# EAGLE design binary_clock_rev2 (EAGLE 6.0)
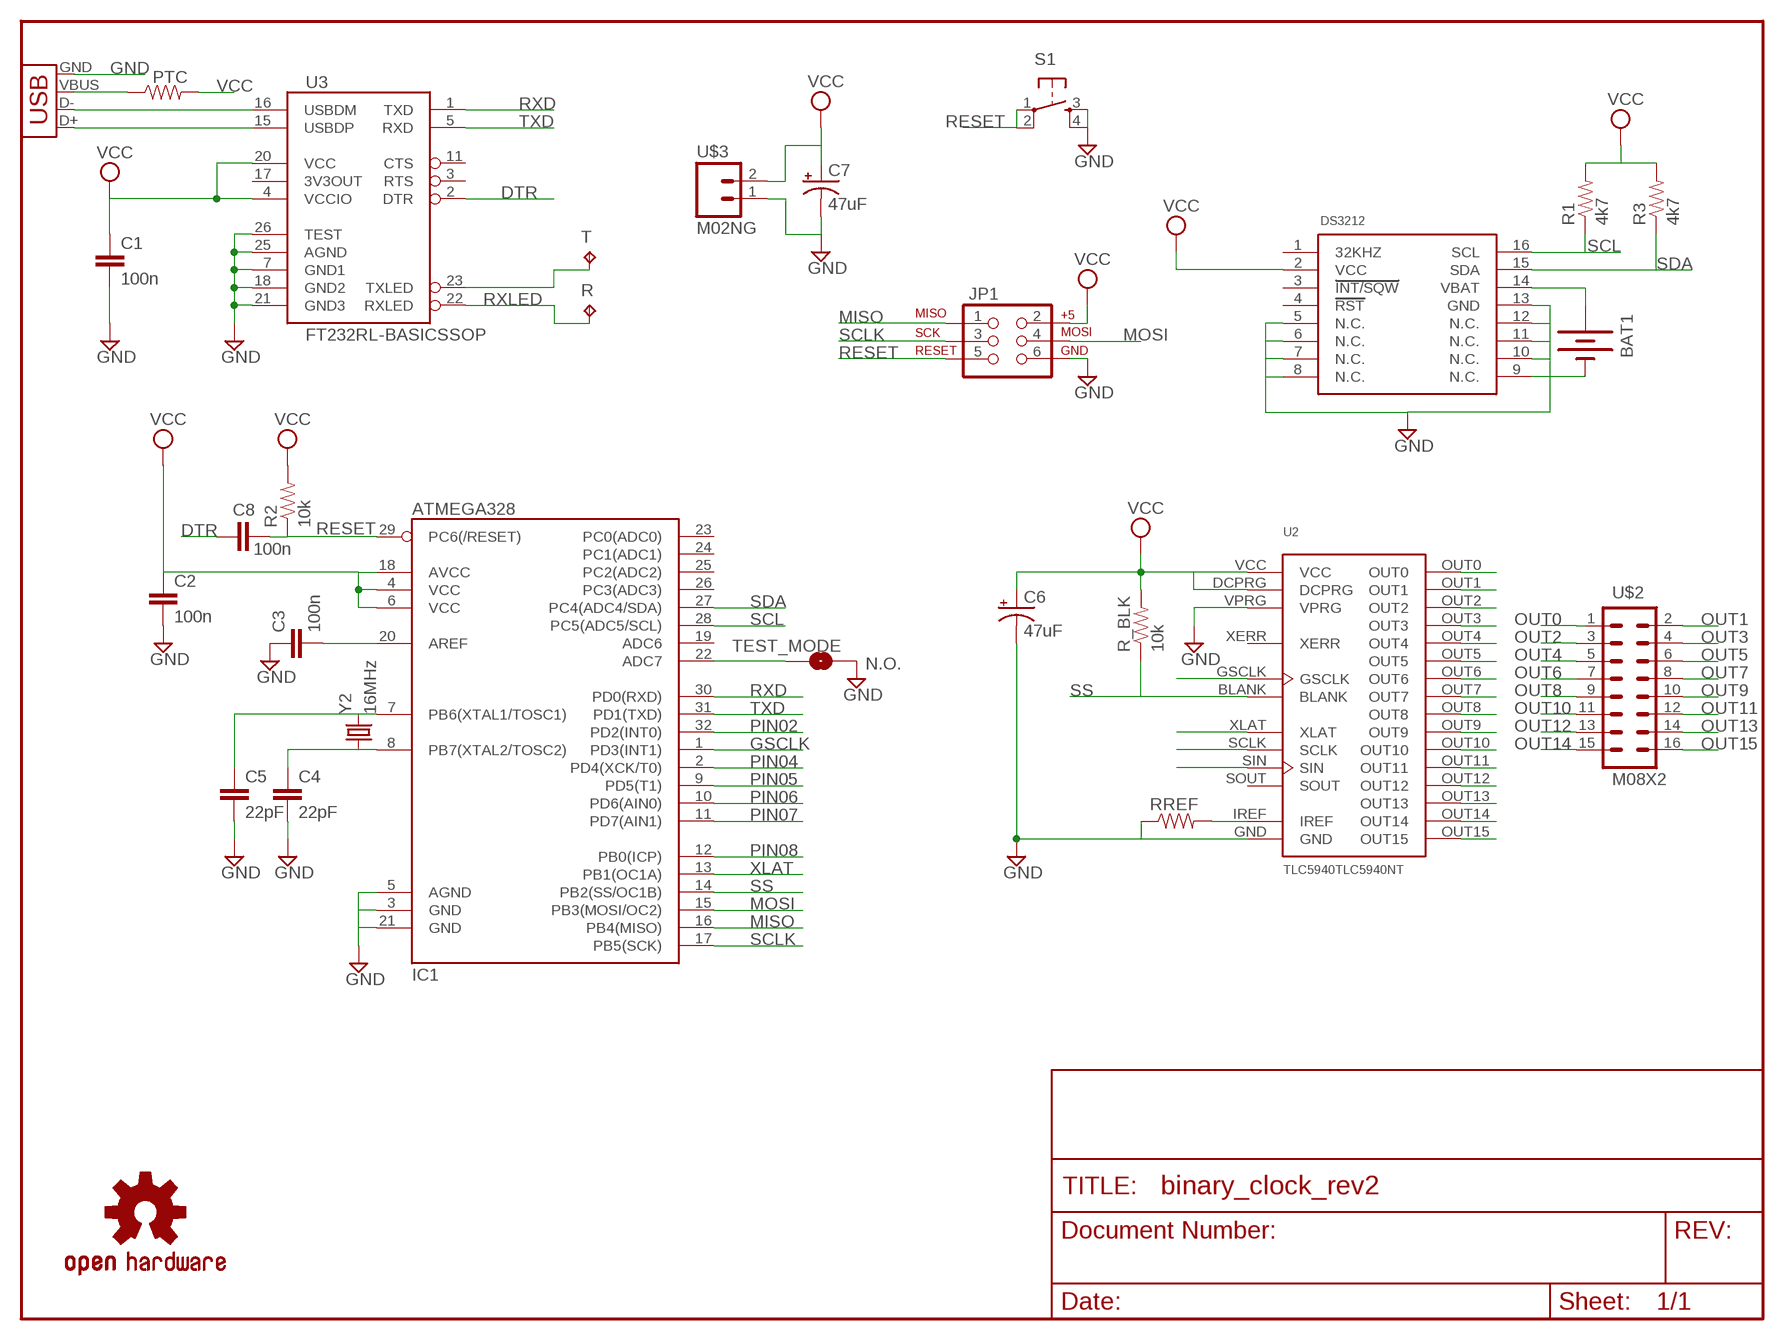
[diagram p0: schematic, sheet 1]

## Parts
BAT1  BATTERY12MM  [BATTCON_12MM]
C1  100n  CAP1206  [1206]
C2  100n  CAP1206  [1206]
C3  100n  CAP1206  [1206]
C4  22pF  CAP1206  [1206]
C5  22pF  CAP1206  [1206]
C6  47uF  CPOL-USD/7343-31W  [D/7343-31W]
C7  47uF  CPOL-USD/7343-31W  [D/7343-31W]
C8  100n  CAP1206  [1206]
DS3212  DS3231  [SO16L]
IC1  ATMEGA328  ATMEGA168  [TQFP32-08]
JP1  AVR_SPI_PRG_62X3_LOCK  [2X3_LOCK]
PTC  RESISTOR1206  [1206]
R  TPB1,27  [B1,27]
R1  4k7  RESISTOR1206  [1206]
R2  10k  RESISTOR1206  [1206]
R3  4k7  RESISTOR1206  [1206]
R_BLK  10k  RESISTOR1206  [1206]
RREF  2.2k  RESISTOR1206  [1206]
S1  TAC_SWITCHSMD  [TACTILE_SWITCH_SMD]
T  TPB1,27  [B1,27]
TEST_MODE  N.O.  SOLDERJUMPERNO  [SJ_2S-NO]
U2  TLC5940TLC5940NT  [DIL28-3]
U3  FT232RL-BASICSSOP  [SSOP28DB]
U$1  OSHW-LOGOM  [OSHW-LOGO-M]
U$2  M08X2  [2X8]
U$3  M02NG  [1X02]
X1  USBSMD  [USB-MINIB]
Y2  16MHz  CRYSTALHC49US  [HC49US]

## Nets
DTR: C8.1 U3.2(DTR)
GND: BAT1.GND(-) C1.2 C2.2 C3.1 C4.2 C5.2 C6.- C7.- DS3212.5(N.C.) DS3212.6(N.C.) DS3212.7(N.C.) DS3212.8(N.C.) DS3212.9(N.C.) DS3212.10(N.C.) DS3212.11(N.C.) DS3212.12(N.C.) DS3212.13(GND) IC1.3(GND) IC1.5(AGND) IC1.21(GND) JP1.6 RREF.1 S1.3 S1.4 TEST_MODE.2 U2.GND U2.VPRG U3.7(GND1) U3.18(GND2) U3.21(GND3) U3.25(AGND) U3.26(TEST) U$3.1 X1.GND
GSCLK: IC1.1(PD3(INT1)) U2.GSCLK
MISO: IC1.16(PB4(MISO)) JP1.1
MOSI: IC1.15(PB3(MOSI/OC2)) JP1.4 U2.SIN
N$1: IC1.22(ADC7) TEST_MODE.1
N$2: BAT1.PWR@2(+) DS3212.14(VBAT)
N$14: U3.15(USBDP) X1.D+
N$15: U3.16(USBDM) X1.D-
N$16: C3.2 IC1.20(AREF)
N$17: PTC.1 X1.VBUS
N$18: RREF.2 U2.IREF
N$21: C5.1 IC1.7(PB6(XTAL1/TOSC1)) Y2.2
N$22: C4.1 IC1.8(PB7(XTAL2/TOSC2)) Y2.1
OUT0: U2.OUT0 U$2.1
OUT1: U2.OUT1 U$2.2
OUT2: U2.OUT2 U$2.3
OUT3: U2.OUT3 U$2.4
OUT4: U2.OUT4 U$2.5
OUT5: U2.OUT5 U$2.6
OUT6: U2.OUT6 U$2.7
OUT7: U2.OUT7 U$2.8
OUT8: U2.OUT8 U$2.9
OUT9: U2.OUT9 U$2.10
OUT10: U2.OUT10 U$2.11
OUT11: U2.OUT11 U$2.12
OUT12: U2.OUT12 U$2.13
OUT13: U2.OUT13 U$2.14
OUT14: U2.OUT14 U$2.15
OUT15: U2.OUT15 U$2.16
PIN02: IC1.32(PD2(INT0))
PIN04: IC1.2(PD4(XCK/T0))
PIN05: IC1.9(PD5(T1))
PIN06: IC1.10(PD6(AIN0))
PIN07: IC1.11(PD7(AIN1))
PIN08: IC1.12(PB0(ICP))
RESET: C8.2 IC1.29(PC6(/RESET)) JP1.5 R2.1 S1.1 S1.2
RXD: IC1.30(PD0(RXD)) U3.1(TXD)
RXLED: R.TP U3.22(RXLED)
SCL: DS3212.16(SCL) IC1.28(PC5(ADC5/SCL)) R1.1
SCLK: IC1.17(PB5(SCK)) JP1.3 U2.SCLK
SDA: DS3212.15(SDA) IC1.27(PC4(ADC4/SDA)) R3.1
SS: IC1.14(PB2(SS/OC1B)) R_BLK.1 U2.BLANK
TXD: IC1.31(PD1(TXD)) U3.5(RXD)
TXLED: T.TP U3.23(TXLED)
VCC: C1.1 C2.1 C6.+ C7.+ DS3212.2(VCC) IC1.4(VCC) IC1.6(VCC) IC1.18(AVCC) JP1.2 PTC.2 R1.2 R2.2 R3.2 R_BLK.2 U2.DCPRG U2.VCC U3.4(VCCIO) U3.20(VCC) U$3.2
XLAT: IC1.13(PB1(OC1A)) U2.XLAT
Unconnected: DS3212.1(32KHZ) DS3212.3(INT/SQW) DS3212.4(RST) IC1.19(ADC6) IC1.23(PC0(ADC0)) IC1.24(PC1(ADC1)) IC1.25(PC2(ADC2)) IC1.26(PC3(ADC3)) U2.SOUT U2.XERR U3.3(RTS) U3.11(CTS) U3.17(3V3OUT)

## Library data of the parts
BAT1 = Add-Ohms:BATTERY: Battery Holders Various common sizes : AA, AAA, 20mm coin cell and 12mm coin cell.
C1-C3 C8 = SparkFun:CAP: Capacitor Standard 0603 ceramic capacitor, and 0.1" leaded capacitor.
C4 C5 = JitterLab:CAP: Capacitor Standard 0603 ceramic capacitor, and 0.1" leaded capacitor.
C6 C7 = rcl:CPOL-US: POLARIZED CAPACITOR, American symbol
DS3212 = Add-Ohms:DS3231: The DS3231 is a low-cost, extremely accurate I2C real- time clock (RTC) with an integrated temperature- compensated crystal oscillator (TCXO) and crystal. Link to maxim-ic.com: http://www.maxim-ic.com/datasheet/index.mvp/id/4627 The package style is the SOIC-16. This Part was created by James Lewis (james@cmiyc.com). The SMD/PCB footprint was obtained from the Sparkfun Eagle Library. This part (as an indepedant library) can be downloaded from cmiyc.com: <insert link>. Last Update: May 28, 2012.
IC1 = SparkFun:ATMEGA168
JP1 = SparkFun:AVR_SPI_PRG_6: AVR ISP 6 Pin This is the reduced ISP connector for AVR programming. Common on Arduino. This footprint will take up less PCB space and can be used with a 10-pin to 6-pin adapter such as SKU: BOB-08508
PTC R1-R3 = SparkFun:RESISTOR: Resistor Basic schematic elements and footprints for 0603, 1206, and PTH resistors.
R T = testpad:TP: Test pad
R_BLK RREF = JitterLab:RESISTOR: Resistor Basic schematic elements and footprints for 0603, 1206, and PTH resistors.
S1 = SparkFun:TAC_SWITCH: Momentary Switch Button commonly used for reset or general input. Spark Fun Electronics SKU : COM-00097
TEST_MODE = SparkFun:SOLDERJUMPER: Solder Jumper Standard SMD solder jumper. Used to automate production. Two varients : Normally Open and Normally Closed are the same, but have different paste layers. NC will have a large amount of paste and should jumper during reflow.
U2 = TLC5940NT:TLC5940
U3 = SparkFun:FT232RL-BASIC: USB UART This is the simplified version of the FT232RL unit. Only what you need, nothing you don't. Spark Fun Electronics SKU : COM-00650
U$1 = Add-Ohms:OSHW-LOGO: Open Source Hardware Logo This logo indicates the piece of hardware it is found on incorporates a OSHW license and/or adheres to the definition of open source hardware found here: http://freedomdefined.org/OSHW
U$2 = SparkFun:M08X2
U$3 = SparkFun:M02NG
X1 = SparkFun:USB: USB Connectors USB-B-PTH is fully proven SKU : PRT-00139 USB-miniB is fully proven SKU : PRT-00587 USB-A-PCB is untested. USB-A-H is throughly reviewed, but untested. Spark Fun Electronics SKU : PRT-00437 USB-B-SMT is throughly reviewed, but untested. Needs silkscreen touching up. USB-A-S has not been used/tested USB-MB-H has not been used/tested
Y2 = SparkFun:CRYSTAL: Crystals Various standard crystals. Proven footprints. Spark Fun Electronics SKU : COM-00534

## Board
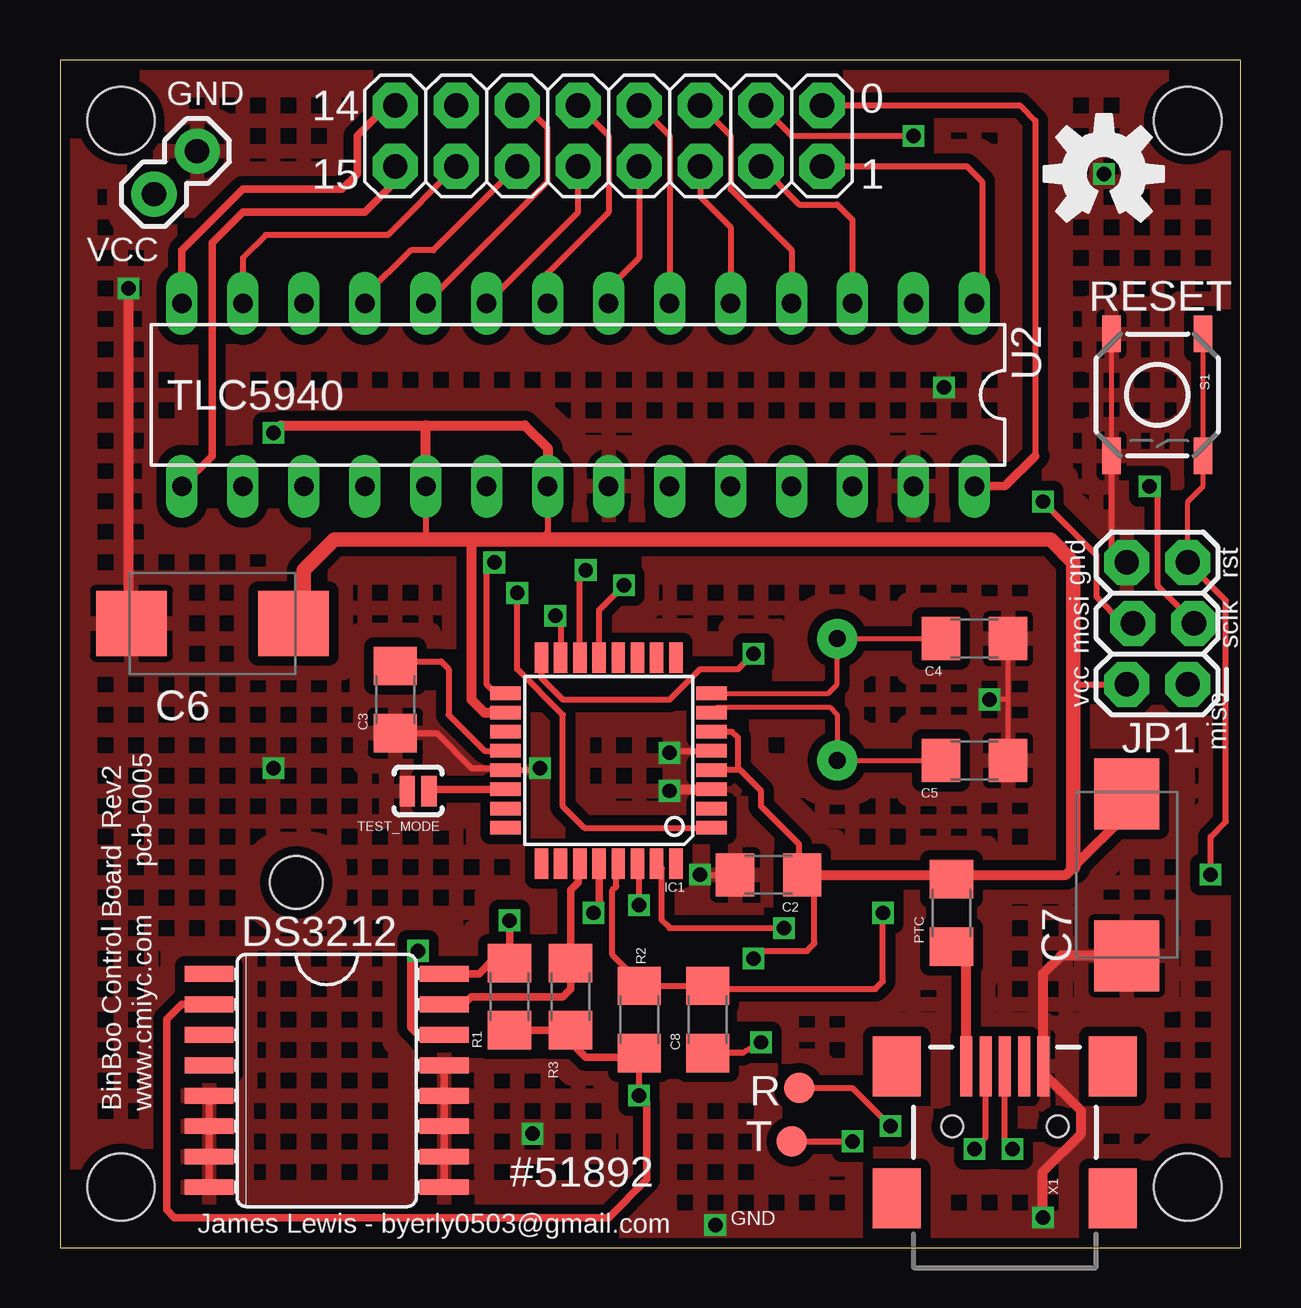
[diagram p1: board, top side]
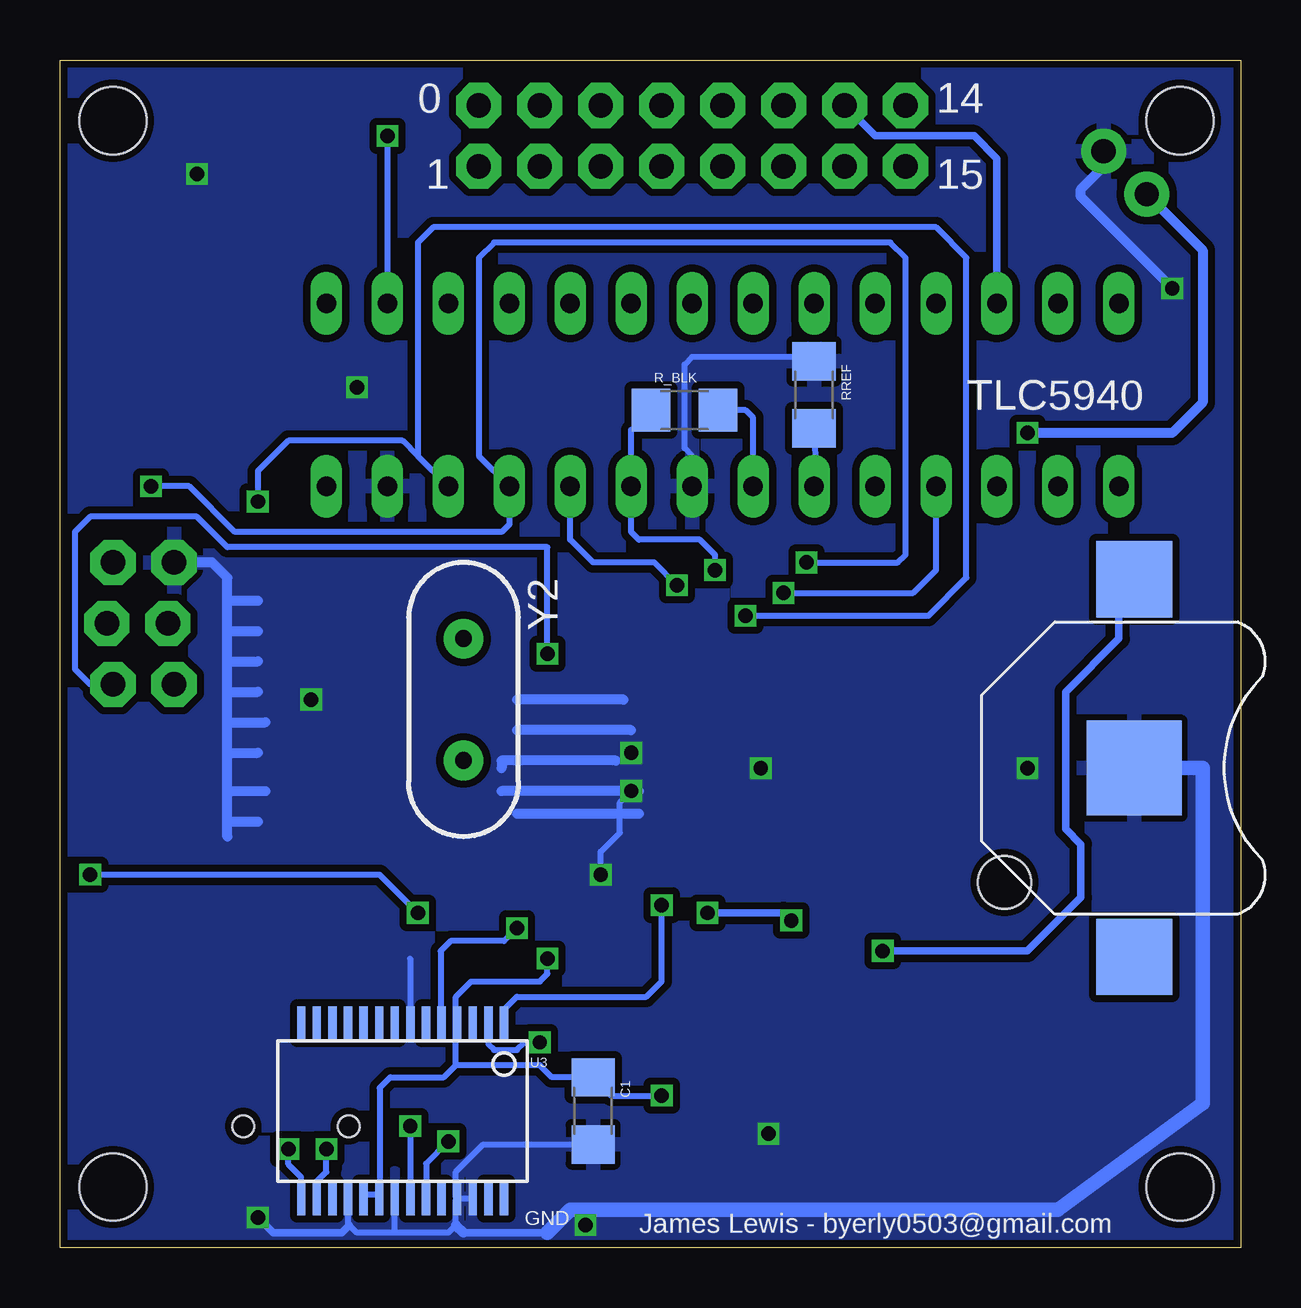
[diagram p2: board, bottom side, seen from below]

Size 49.2 x 49.52 mm. Coordinates in mm from the lower left corner, seen from the top.
Outline: 0,0 49.2,0 49.2,49.52 0,49.52 0,0
Copper layers (1*16): Top 0.035mm / dielectric 1.5mm / Bottom 0.035mm
Design rules: minimum track width 6mil, minimum drill 12mil, track to track 6mil, track to pad 6mil, pad to pad 6mil, via to via 6mil, smd to smd 0mil, copper to edge 10mil, drill to drill 10mil, minimum pad ring 10mil, minimum via ring 6mil, stop-mask expansion 2mil, vias tented up to drill 100mil, thermal gap 10mil
Holes 2.8 mm at 46.99,46.99 46.99,2.54 2.54,2.54 2.54,46.99
Holes 2.2 mm at 9.84,15.24

### Footprints (pad centres in the part's own frame; a part is rotated, then mirrored left to right if it is on the bottom)
BATTCON_12MM = smd 3.962 x 3.962: GND 0,0 | smd 3.175 x 3.175: PWR@1 7.874,0; PWR@2 -7.874,0
1206 = smd 1.6 x 1.8: 1 -1.4,0; 2 1.4,0
D/7343-31W = smd 2.95 x 2.7: + 3.375,0; - -3.375,0
SO16L = smd 0.66 x 2.032: 1 -4.445,-4.902; 2 -3.175,-4.902; 3 -1.905,-4.902; 4 -0.635,-4.902; 5 0.635,-4.902; 6 1.905,-4.902; 7 3.175,-4.902; 8 4.445,-4.902; 9 4.445,4.902; 10 3.175,4.902; 11 1.905,4.902; 12 0.635,4.902; 13 -0.635,4.902; 14 -1.905,4.902; 15 -3.175,4.902; 16 -4.445,4.902
TQFP32-08 = smd 1.27 x 0.559: 1 -4.293,2.8; 2 -4.293,2; 3 -4.293,1.2; 4 -4.293,0.4; 5 -4.293,-0.4; 6 -4.293,-1.2; 7 -4.293,-2; 8 -4.293,-2.8; 17 4.293,-2.8; 18 4.293,-2; 19 4.293,-1.2; 20 4.293,-0.4; 21 4.293,0.4; 22 4.293,1.2; 23 4.293,2; 24 4.293,2.8 | smd 0.559 x 1.27: 9 -2.8,-4.293; 10 -2,-4.293; 11 -1.2,-4.293; 12 -0.4,-4.293; 13 0.4,-4.293; 14 1.2,-4.293; 15 2,-4.293; 16 2.8,-4.293; 25 2.8,4.293; 26 2,4.293; 27 1.2,4.293; 28 0.4,4.293; 29 -0.4,4.293; 30 -1.2,4.293; 31 -2,4.293; 32 -2.8,4.293
2X3_LOCK = drill 1.016 pad 1.88 octagon: 1 0,0; 2 0,2.54; 3 2.54,-0.254; 4 2.54,2.286; 5 5.08,0; 6 5.08,2.54
B1,27 = smd 1.27 x 1.27: TP 0,0
TACTILE_SWITCH_SMD = smd 1.524 x 0.762: 1 -2.54,1.905; 2 2.54,1.905; 3 -2.54,-1.905; 4 2.54,-1.905
SJ_2S-NO = smd 0.635 x 1.27: 1 -0.45,0; 2 0.45,0
DIL28-3 = drill 0.813 long: BLANK -3.81,3.81; DCPRG 6.35,3.81; GND -1.27,3.81; GSCLK 8.89,3.81; IREF 3.81,3.81; OUT0 -16.51,3.81; OUT1 -16.51,-3.81; OUT2 -13.97,-3.81; OUT3 -11.43,-3.81; OUT4 -8.89,-3.81; OUT5 -6.35,-3.81; OUT6 -3.81,-3.81; OUT7 -1.27,-3.81; OUT8 1.27,-3.81; OUT9 3.81,-3.81; OUT10 6.35,-3.81; OUT11 8.89,-3.81; OUT12 11.43,-3.81; OUT13 13.97,-3.81; OUT14 16.51,-3.81; OUT15 16.51,3.81; SCLK -8.89,3.81; SIN -11.43,3.81; SOUT 11.43,3.81; VCC 1.27,3.81; VPRG -13.97,3.81; XERR 13.97,3.81; XLAT -6.35,3.81
SSOP28DB = smd 0.348 x 1.397: 1 -4.225,-3.656; 2 -3.575,-3.656; 3 -2.925,-3.656; 4 -2.275,-3.656; 5 -1.625,-3.656; 6 -0.975,-3.656; 7 -0.325,-3.656; 8 0.325,-3.656; 9 0.975,-3.656; 10 1.625,-3.656; 11 2.275,-3.656; 12 2.925,-3.656; 13 3.575,-3.656; 14 4.225,-3.656; 15 4.225,3.656; 16 3.575,3.656; 17 2.925,3.656; 18 2.275,3.656; 19 1.625,3.656; 20 0.975,3.656; 21 0.325,3.656; 22 -0.325,3.656; 23 -0.975,3.656; 24 -1.625,3.656; 25 -2.275,3.656; 26 -2.925,3.656; 27 -3.575,3.656; 28 -4.225,3.656
2X8 = drill 1.016 pad 1.88 octagon: 1 0,0; 2 0,2.54; 3 2.54,0; 4 2.54,2.54; 5 5.08,0; 6 5.08,2.54; 7 7.62,0; 8 7.62,2.54; 9 10.16,0; 10 10.16,2.54; 11 12.7,0; 12 12.7,2.54; 13 15.24,0; 14 15.24,2.54; 15 17.78,0; 16 17.78,2.54
1X02 = drill 1.016 pad 1.88: 1 0,0; 2 2.54,0
USB-MINIB = smd 2.5 x 0.5: D+ 2.5,0; D- 2.5,0.8; GND 2.5,-1.6; ID 2.5,-0.8; VBUS 2.5,1.6 | smd 2.5 x 2: MTN1 -3,4.5; MTN2 2.5,4.5; MTN3 -3,-4.5; MTN4 2.5,-4.5 | hole 0.9: 0,2.2; 0,-2.2
HC49US = drill 0.7 pad 1.651: 1 -2.54,0; 2 2.54,0

### Placement (x,y rotation side)
BAT1  4.45,20 270 bottom
C1  26.99,5.71 270 bottom
C2  29.53,15.56 180 top
C3  13.97,22.86 90 top
C4  38.1,25.4 0 top
C5  38.1,20.32 0 top
C6  6.35,26.04 0 top
C7  44.45,15.56 90 top
C8  26.99,9.53 90 top
DS3212  11.11,6.99 270 top
IC1  22.86,20.32 180 top
JP1  46.99,23.5 90 top
PTC  37.15,13.97 90 top
R  30.8,6.67 0 top
R1  18.73,10.48 270 top
R2  24.13,9.53 270 top
R3  21.27,10.48 270 top
R_BLK  23.18,34.92 0 bottom
RREF  17.78,35.56 270 bottom
S1  45.72,35.56 270 top
T  30.48,4.45 0 top
TEST_MODE  14.92,19.05 180 top
U2  21.59,35.56 180 top
U3  34.92,5.71 180 bottom
U$1  43.5,44.77 0 top
U$2  31.75,47.62 180 top
U$3  5.71,45.72 225 top
X1  39.37,5.08 90 top
Y2  32.38,22.86 270 bottom

### Tracks (layer width: path | path; a pad name or v marks a point on that pad's centre or on a via)
DTR  (via drill 0.6)
  Top 0.254: v29.21,8.57 28.45,8.12 C8.1
  Bottom 0.254: U3.2 31.35,8.49 31.11,8.26 30.16,8.26 29.84,8.57 v29.21,8.57
GND  (via drill 0.6)
  Top 0.203: C5.2 39.5,22.86 | 39.5,22.86 C4.2 | 39.5,22.86 v38.73,22.86 | S1.4 S1.3
  Top 0.254: v20,20 19.92,19.92 IC1.21 18.48,20 17.14,20 15.69,21.46 C3.1 | v25.4,19.05 25.56,18.89 | v26.67,15.56 C2.2 | IC1.5 25.48,20.72 v25.4,20.64 | S1.4 43.81,29.21 JP1.6
  Top 0.305: DS3212.13 DS3212.12 DS3212.11 DS3212.10 DS3212.9 | DS3212.8 DS3212.7 DS3212.6 DS3212.5
  Top 0.406: IC1.3 25.47,19.12 v25.4,19.05 | v40.96,1.27 40.96,3.17 42.55,4.76 42.55,5.71 40.97,7.29 X1.GND 40.97,8.59 40.96,8.6 40.96,11.43 41.71,12.18 C7.- | C6.- 2.86,26.15 v2.86,40.01
  Top 0.61: JP1.6 44.45,29.21
  Bottom 0.254: U3.18 37.2,1 37.15,0.95 36.83,0.64 35.24,0.64 | 35.24,0.64 33.02,0.64 32.7,0.95 32.7,1.91 | 32.7,1.91 32.7,2.01 U3.25 | U3.21 35.25,0.64 35.24,0.64 | C1.2 31.56,4.32 32.7,3.17 32.7,2.11 U3.25 | 34.61,12.06 U3.7 | v20,20 20.32,20 | v26.67,15.56 26.67,16.51 25.88,17.3 25.88,18.57 v25.4,19.05 | 25.08,20.64 v25.4,20.64 | U3.26 32.55,2.06 32.65,1.96 | U3.25 32.65,1.96 | 32.65,1.96 32.7,1.91 | U2.GND 22.86,33.02 23.18,33.34 23.18,36.83 22.86,37.15 17.97,37.15 RREF.1
  Bottom 0.305: v40.96,1.27 40.32,0.64 37.47,0.64 37.15,0.95 | 28.89,0.64 32.38,0.64
  Bottom 0.406: 32.38,0.64 32.7,0.95 | 26.04,20.32 30.8,20.32 30.8,20 | 30.8,19.05 v25.4,19.05 25.08,19.05 | JP1.6 42.86,28.57 42.23,27.94 42.23,26.99 | 42.23,17.14 42.23,17.78 | 42.23,17.78 42.23,19.05 | 42.23,19.05 42.23,20.64 | 42.23,20.64 42.23,21.91 | 42.23,21.91 42.23,23.18 | 42.23,23.18 42.23,24.45 | 42.23,24.45 42.23,25.72 | 42.23,25.72 42.23,26.99 | 42.23,17.78 40.96,17.78 | 42.23,19.05 40.64,19.05 | 42.23,20.64 40.96,20.64 | 42.23,21.91 40.64,21.91 | 42.23,23.18 40.96,23.18 | 42.23,24.45 40.96,24.45 | 42.23,25.72 40.96,25.72 | 42.23,26.99 40.96,26.99 | 25.72,22.86 30.16,22.86 | 25.4,21.59 30.16,21.59 | 25.08,18.1 30.16,18.1 | v2.86,40.01 6.67,43.81 6.67,44.13 5.71,45.09 U$3.1
  Bottom 0.61: 28.89,0.64 27.94,1.59 7.62,1.59 1.59,6.03 1.59,20 BAT1.GND
  other vias: 43.5,44.77 19.68,4.76 8.89,20 36.83,35.88 27.3,0.95
  pour Bottom (isolate 0.305): 19.68,23.5 26.04,23.5 26.04,17.14 19.68,17.14
  pour Bottom (isolate 0.305): 30.8,28.57 40.96,28.57 40.96,16.83 29.84,16.83 29.84,28.57
  pour Bottom (isolate 0.305): 0.32,49.21 48.9,49.21 48.9,0.64 0.32,0.64
  pour Top (isolate 0.406, hatched): 0.32,49.21 48.9,49.21 48.9,0.64 0.32,0.64
GSCLK  (via drill 0.6)
  Top 0.254: IC1.1 21.85,17.52 20.95,18.41 20.95,22.23 19.05,24.13 v19.05,27.3
  Bottom 0.254: v19.05,27.3 13.65,27.3 12.7,28.26 U2.GSCLK
MISO  (via drill 0.6)
  Top 0.254: IC1.16 20.06,23.75 20.95,22.86 25.4,22.86 26.67,24.13 28.26,24.13 v28.89,24.77
  Bottom 0.254: v28.89,24.77 28.89,29.21 42.23,29.21 43.5,30.48 47.94,30.48 48.58,29.84 48.58,24.13 47.94,23.5 JP1.1
MOSI  (via drill 0.6)
  Top 0.254: IC1.15 20.86,26.13 v20.64,26.35 | JP1.4 44.29,26.04 43.18,27.15 43.18,28.89 v40.96,31.11
  Bottom 0.254: v20.64,26.35 13.02,26.35 11.43,27.94 11.43,41.27 12.7,42.55 33.66,42.55 34.29,41.91 34.29,33.02 | 34.29,33.02 U2.SIN | v40.96,31.11 40.96,32.38 39.69,33.66 34.92,33.66 34.29,33.02
N$1
  Top 0.305: IC1.22 15.31,19.12 15.24,19.05 TEST_MODE.1
N$2  (via drill 0.6)
  Top 0.305: DS3212.14 14.92,8.89 14.61,9.21 14.61,12.06 v14.92,12.38
  Bottom 0.305: v14.92,12.38 8.89,12.38 6.67,14.61 6.67,16.83 7.3,17.46 7.3,23.18 5.08,25.4 5.08,27.24 BAT1.PWR@2
N$14  (via drill 0.6)
  Top 0.254: X1.D+ 39.37,4.45 v39.69,4.13
  Bottom 0.254: U3.15 39.15,2.96 39.69,3.49 v39.69,4.13
N$15  (via drill 0.6)
  Top 0.254: X1.D- 38.57,4.6 v38.1,4.13
  Bottom 0.254: U3.16 38.5,2.77 38.1,3.17 v38.1,4.13
N$16
  Top 0.254: IC1.20 17.7,20.72 16.19,22.23 16.19,24.13 15.88,24.45 14.16,24.45 C3.2
N$17
  Top 0.406: 37.78,7.59 X1.VBUS 37.77,11.95 PTC.1
N$18
  Bottom 0.254: RREF.2 17.65,31.88 U2.IREF
N$21
  Top 0.203: IC1.7 27.38,22.54 32.07,22.54 32.38,22.23 Y2.2 C5.1
N$22
  Top 0.203: IC1.8 32.01,23.12 32.38,23.5 Y2.1 C4.1
OUT0
  Top 0.254: U$2.1 40.01,47.62 40.64,46.99 40.64,33.02
  Top 0.35: U2.OUT0 39.37,31.75 40.64,33.02
OUT1
  Top 0.254: U$2.2 37.78,45.09 38.42,44.45 38.42,40.01 38.1,39.69 U2.OUT1
OUT2  (via drill 0.6)
  Top 0.254: U$2.3 30.48,46.35 v35.56,46.35
  Bottom 0.254: v35.56,46.35 U2.OUT2
OUT3
  Top 0.254: U$2.4 30.8,43.5 32.38,43.5 33.02,42.86 U2.OUT3
OUT4
  Top 0.254: U$2.5 27.94,46.35 27.94,44.13 30.48,41.59 U2.OUT4
OUT5
  Top 0.254: U$2.6 26.67,43.81 27.94,42.55 U2.OUT5
OUT6
  Top 0.254: U$2.7 25.4,46.35 U2.OUT6
OUT7
  Top 0.254: U$2.8 24.13,41.27 22.86,40.01 U2.OUT7
OUT8
  Top 0.254: U$2.9 22.86,46.35 22.86,43.18 20.32,40.64 U2.OUT8
OUT9
  Top 0.254: U2.OUT9 21.59,43.18 U$2.10
OUT10
  Top 0.254: U2.OUT10 20.32,44.45 20.32,46.67 19.37,47.62 U$2.11
OUT11
  Top 0.254: U$2.12 15.56,41.59 14.61,41.59 12.7,39.69 U2.OUT11
OUT12
  Bottom 0.305: U2.OUT12 10.16,45.4 11.11,46.35 15.24,46.35 U$2.13
OUT13
  Top 0.254: U$2.14 13.65,42.23 8.57,42.23 7.62,41.27 U2.OUT13
OUT14
  Top 0.305: U2.OUT14 5.08,41.59 7.62,44.13 11.75,44.13 12.38,44.77 12.38,46.35 13.65,47.62 U$2.15
OUT15
  Top 0.305: U2.OUT15 6.35,33.02 6.35,41.91 7.62,43.18 12.7,43.18 13.97,44.45 U$2.16
RESET  (via drill 0.6)
  Top 0.203: JP1.5 46.99,31.11 47.62,31.75 S1.2 S1.1
  Top 0.254: IC1.29 23.18,15.95 23.18,15.08 23.02,14.92 23.02,12.22 24.13,11.11 R2.1 C8.2 27.12,10.79 33.97,10.79 34.29,11.11 v34.29,13.97 | JP1.5 48.58,26.99 48.58,17.78 47.94,17.14 v47.94,15.56
  Bottom 0.254: v34.29,13.97 35.88,15.56 v47.94,15.56
RXD  (via drill 0.6)
  Top 0.254: v24.13,14.29 24.13,15.96 IC1.30
  Bottom 0.254: U3.1 30.7,9.94 30.16,10.48 24.77,10.48 24.13,11.11 v24.13,14.29
RXLED  (via drill 0.6)
  Top 0.254: R.TP 33.02,6.67 v34.61,5.08
  Bottom 0.254: v34.61,5.08 U3.22
SCL  (via drill 0.6)
  Top 0.305: IC1.28 22.46,14.21 v22.23,13.97 | v18.73,13.65 R1.1 17.91,11.88 17.46,11.43 DS3212.16
  Bottom 0.305: v22.23,13.97 19.05,13.97 v18.73,13.65
SCLK  (via drill 0.6)
  Top 0.254: IC1.17 18.16,23.12 17.78,23.5 17.78,28.26 v18.1,28.57 | JP1.3 47.24,26.1 45.72,27.62 45.72,31.43 v45.4,31.75
  Bottom 0.254: v18.1,28.57 14.29,28.57 13.97,28.89 13.97,41.27 14.61,41.91 31.11,41.91 31.75,41.27 31.75,33.02 U2.SCLK 30.48,30.16 30.8,29.84 41.91,29.84 43.81,31.75 v45.4,31.75
SDA
  Top 0.305: DS3212.15 16.83,10.16 17.14,10.48 20.95,10.48 21.27,10.79 R3.1 21.27,14.92 21.59,15.24 21.59,15.96 IC1.27
SS  (via drill 0.6)
  Top 0.254: IC1.14 21.66,28.01 v21.91,28.26
  Bottom 0.254: v21.91,28.26 21.91,28.89 22.54,29.53 25.08,29.53 25.4,29.84 U2.BLANK 25.4,34.1 R_BLK.1
TXD  (via drill 0.6)
  Top 0.254: v30.16,13.34 25.4,13.34 25.08,13.65 25.08,15.8 IC1.31
  Bottom 0.254: v30.16,13.34 30.7,12.8 32.92,12.8 33.34,12.38 33.34,9.41 U3.5
TXLED  (via drill 0.6)
  Top 0.254: T.TP v33.02,4.45
  Bottom 0.254: U3.23 33.95,3.52 v33.02,4.45
VCC  (via drill 0.6)
  Top 0.254: 24.26,8.26 R2.2 v24.13,6.35 | v28.89,12.06 29.21,12.38 31.11,12.38 31.43,12.7 31.43,15.56 | 28.34,19.92 IC1.4 | 28.34,19.92 29.21,19.05 29.21,18.41 30.8,16.83 30.8,15.69 C2.1 | IC1.6 28.01,21.52 28.26,21.27 28.26,20 28.34,19.92 | 20,29.53 20.32,29.84 U2.VCC | 42.23,23.5 JP1.2 | U2.DCPRG 15.24,29.53
  Top 0.305: R2.2 23.94,7.94 21.91,7.94 21.27,8.57 R3.2 R1.2 | DS3212.2 5.08,10.16 4.45,9.53 4.45,1.59 4.76,1.27 22.86,1.27 24.45,2.86 24.45,6.03 v24.13,6.35
  Top 0.406: IC1.18 17.68,22.32 17.14,22.86 17.14,29.53 | 37.78,15.56 31.43,15.56 C2.1 | 37.78,15.56 41.91,15.56 42.23,15.88 44.45,18.1 C7.+ | PTC.2 37.59,15.37 37.78,15.56 | 15.24,34.29 19.37,34.29 20.32,33.34 U2.VCC | U2.DCPRG 15.24,34.29 | v8.89,33.97 9.21,34.29 15.24,34.29
  Top 0.61: 42.23,15.88 42.23,23.5 42.23,28.57 41.27,29.53 20,29.53 17.14,29.53 15.24,29.53 11.43,29.53 10.16,28.26 10.16,26.47 C6.+
  Bottom 0.254: 35.88,2.22 35.88,6.67 35.43,7.12 33.21,7.12 32.7,7.62 | 35.88,2.22 35.88,2.08 U3.20 | 32.7,9.37 U3.4 32.7,9.42 | 32.7,7.62 32.7,9.42 | 35.88,2.22 36.51,2.22 | U2.VCC 20.32,34.61 20.64,34.92 R_BLK.2 | v24.13,6.35 26.22,6.35 C1.1 28.7,7.12 29.21,7.62 32.7,7.62 | 32.7,9.42 32.7,10.48 32.07,11.11 29.21,11.11 28.89,11.43 v28.89,12.06
  Bottom 0.406: U$3.2 1.59,41.59 1.59,35.24 2.86,33.97 v8.89,33.97
XLAT  (via drill 0.6)
  Top 0.254: IC1.13 22.46,26.59 v23.5,27.62
  Bottom 0.254: v23.5,27.62 24.45,28.57 26.99,28.57 27.94,29.53 U2.XLAT

### Text on the board
tNames: GND | 14 | 0 | 15 | 1 | VCC | RESET | TLC5940 | rst | gnd | sclk | mosi | vcc | miso | Rev2 | pcb-0005 | BinBoo Control Board | www.cmiyc.com | #51892 | James Lewis - byerly0503@gmail.com | GND
bNames: 14 | 0 | 15 | 1 | TLC5940 | James Lewis - byerly0503@gmail.com | GND